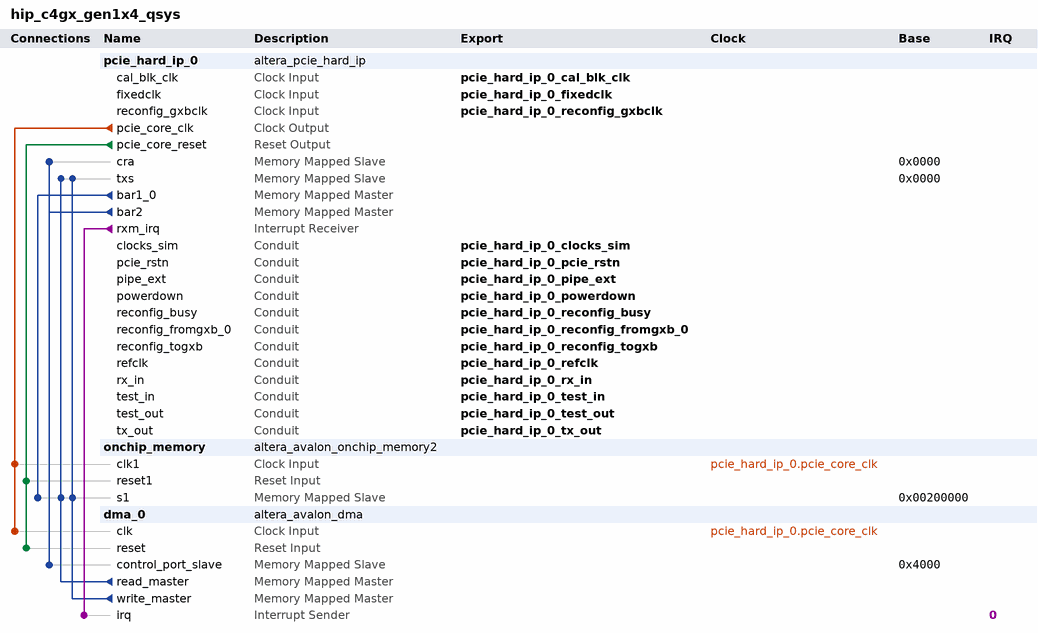
[diagram p0: system contents]
# Platform Designer (Qsys) system hip_c4gx_gen1x4_qsys, Cyclone IV GX Unknown
# Parameters at their usual value, and those the tool derives, are not listed.
package require -exact qsys 14.1
create_system hip_c4gx_gen1x4_qsys
set_project_property DEVICE_FAMILY {Cyclone IV GX}
set_project_property DEVICE Unknown

add_instance pcie_hard_ip_0 altera_pcie_hard_ip 14.1
set_instance_parameter_value pcie_hard_ip_0 max_link_width 4
set_instance_parameter_value pcie_hard_ip_0 p_pcie_test_out_width 64bits
set_instance_parameter_value pcie_hard_ip_0 {BAR Type} {64 bit Prefetchable,Not used,32 bit Non-Prefetchable,Not used,Not used,Not used}
set_instance_parameter_value pcie_hard_ip_0 vendor_id 4466
set_instance_parameter_value pcie_hard_ip_0 device_id 4
set_instance_parameter_value pcie_hard_ip_0 class_code 16711680
set_instance_parameter_value pcie_hard_ip_0 subsystem_vendor_id 4466
set_instance_parameter_value pcie_hard_ip_0 subsystem_device_id 4
set_instance_parameter_value pcie_hard_ip_0 my_advanced_errors false
set_instance_parameter_value pcie_hard_ip_0 my_enable_ecrc_check false
set_instance_parameter_value pcie_hard_ip_0 my_enable_ecrc_gen false
set_instance_parameter_value pcie_hard_ip_0 p_pcie_target_performance_preset High
set_instance_parameter_value pcie_hard_ip_0 CG_NO_CPL_REORDERING 0
set_instance_parameter_value pcie_hard_ip_0 CG_ENABLE_A2P_INTERRUPT 1
set_instance_parameter_value pcie_hard_ip_0 p_user_msi_enable 0
set_instance_parameter_value pcie_hard_ip_0 CB_A2P_ADDR_MAP_IS_FIXED 0
set_instance_parameter_value pcie_hard_ip_0 CB_A2P_ADDR_MAP_NUM_ENTRIES 2
set_instance_parameter_value pcie_hard_ip_0 CB_A2P_ADDR_MAP_PASS_THRU_BITS 20
set_instance_parameter_value pcie_hard_ip_0 {PCIe Address 63:32} 0x00000000,0x00000000,0x00000000,0x00000000,0x00000000,0x00000000,0x00000000,0x00000000,0x00000000,0x00000000,0x00000000,0x00000000,0x00000000,0x00000000,0x00000000,0x00000000
set_instance_parameter_value pcie_hard_ip_0 {PCIe Address 31:0} 0x00000000,0x00000000,0x00000000,0x00000000,0x00000000,0x00000000,0x00000000,0x00000000,0x00000000,0x00000000,0x00000000,0x00000000,0x00000000,0x00000000,0x00000000,0x00000000

add_instance onchip_memory altera_avalon_onchip_memory2 14.1
set_instance_parameter_value onchip_memory dataWidth 64
set_instance_parameter_value onchip_memory dualPort false
set_instance_parameter_value onchip_memory initMemContent true
set_instance_parameter_value onchip_memory initializationFileName onchip_memory
set_instance_parameter_value onchip_memory memorySize 4096

add_instance dma_0 altera_avalon_dma 14.1
set_instance_parameter_value dma_0 allowByteTransactions true
set_instance_parameter_value dma_0 allowDoubleWordTransactions true
set_instance_parameter_value dma_0 allowHalfWordTransactions true
set_instance_parameter_value dma_0 allowQuadWordTransactions true
set_instance_parameter_value dma_0 burstEnable true
set_instance_parameter_value dma_0 fifoDepth 32
set_instance_parameter_value dma_0 maxBurstSize 128
set_instance_parameter_value dma_0 minimumDmaTransactionRegisterWidth 13

# connections
add_connection pcie_hard_ip_0.pcie_core_clk dma_0.clk clock
add_connection pcie_hard_ip_0.pcie_core_clk onchip_memory.clk1 clock
add_connection pcie_hard_ip_0.pcie_core_reset dma_0.reset reset
add_connection pcie_hard_ip_0.pcie_core_reset onchip_memory.reset1 reset
add_connection dma_0.read_master onchip_memory.s1 avalon
set_connection_parameter_value dma_0.read_master/onchip_memory.s1 baseAddress 0x00200000
add_connection dma_0.read_master pcie_hard_ip_0.txs avalon
set_connection_parameter_value dma_0.read_master/pcie_hard_ip_0.txs baseAddress 0x0000
add_connection dma_0.write_master onchip_memory.s1 avalon
set_connection_parameter_value dma_0.write_master/onchip_memory.s1 baseAddress 0x00200000
add_connection dma_0.write_master pcie_hard_ip_0.txs avalon
set_connection_parameter_value dma_0.write_master/pcie_hard_ip_0.txs baseAddress 0x0000
add_connection pcie_hard_ip_0.bar1_0 onchip_memory.s1 avalon
set_connection_parameter_value pcie_hard_ip_0.bar1_0/onchip_memory.s1 baseAddress 0x00200000
add_connection pcie_hard_ip_0.bar2 dma_0.control_port_slave avalon
set_connection_parameter_value pcie_hard_ip_0.bar2/dma_0.control_port_slave baseAddress 0x4000
add_connection pcie_hard_ip_0.bar2 pcie_hard_ip_0.cra avalon
set_connection_parameter_value pcie_hard_ip_0.bar2/pcie_hard_ip_0.cra baseAddress 0x0000
add_connection pcie_hard_ip_0.rxm_irq dma_0.irq interrupt
set_connection_parameter_value pcie_hard_ip_0.rxm_irq/dma_0.irq irqNumber 0

# exported interfaces
add_interface pcie_hard_ip_0_refclk conduit end
set_interface_property pcie_hard_ip_0_refclk EXPORT_OF pcie_hard_ip_0.refclk
add_interface pcie_hard_ip_0_test_in conduit end
set_interface_property pcie_hard_ip_0_test_in EXPORT_OF pcie_hard_ip_0.test_in
add_interface pcie_hard_ip_0_pcie_rstn conduit end
set_interface_property pcie_hard_ip_0_pcie_rstn EXPORT_OF pcie_hard_ip_0.pcie_rstn
add_interface pcie_hard_ip_0_clocks_sim conduit end
set_interface_property pcie_hard_ip_0_clocks_sim EXPORT_OF pcie_hard_ip_0.clocks_sim
add_interface pcie_hard_ip_0_reconfig_busy conduit end
set_interface_property pcie_hard_ip_0_reconfig_busy EXPORT_OF pcie_hard_ip_0.reconfig_busy
add_interface pcie_hard_ip_0_pipe_ext conduit end
set_interface_property pcie_hard_ip_0_pipe_ext EXPORT_OF pcie_hard_ip_0.pipe_ext
add_interface pcie_hard_ip_0_test_out conduit end
set_interface_property pcie_hard_ip_0_test_out EXPORT_OF pcie_hard_ip_0.test_out
add_interface pcie_hard_ip_0_rx_in conduit end
set_interface_property pcie_hard_ip_0_rx_in EXPORT_OF pcie_hard_ip_0.rx_in
add_interface pcie_hard_ip_0_tx_out conduit end
set_interface_property pcie_hard_ip_0_tx_out EXPORT_OF pcie_hard_ip_0.tx_out
add_interface pcie_hard_ip_0_reconfig_togxb conduit end
set_interface_property pcie_hard_ip_0_reconfig_togxb EXPORT_OF pcie_hard_ip_0.reconfig_togxb
add_interface pcie_hard_ip_0_reconfig_gxbclk clock sink
set_interface_property pcie_hard_ip_0_reconfig_gxbclk EXPORT_OF pcie_hard_ip_0.reconfig_gxbclk
add_interface pcie_hard_ip_0_fixedclk clock sink
set_interface_property pcie_hard_ip_0_fixedclk EXPORT_OF pcie_hard_ip_0.fixedclk
add_interface pcie_hard_ip_0_reconfig_fromgxb_0 conduit end
set_interface_property pcie_hard_ip_0_reconfig_fromgxb_0 EXPORT_OF pcie_hard_ip_0.reconfig_fromgxb_0
add_interface pcie_hard_ip_0_cal_blk_clk clock sink
set_interface_property pcie_hard_ip_0_cal_blk_clk EXPORT_OF pcie_hard_ip_0.cal_blk_clk
add_interface pcie_hard_ip_0_powerdown conduit end
set_interface_property pcie_hard_ip_0_powerdown EXPORT_OF pcie_hard_ip_0.powerdown

set_interconnect_requirement {$system} qsys_mm.clockCrossingAdapter HANDSHAKE
set_interconnect_requirement {$system} qsys_mm.maxAdditionalLatency 2

save_system hip_c4gx_gen1x4_qsys.qsys
